# EAGLE schematic headstage-neuropix (EAGLE 8.3.2)
DESIGNER: JON NEWMAN; DESIGN_NAME: HEADSTAGE-NEUROPIX; LICENSE: CC BY-NC-SA 4.0; REVISION: 1.3
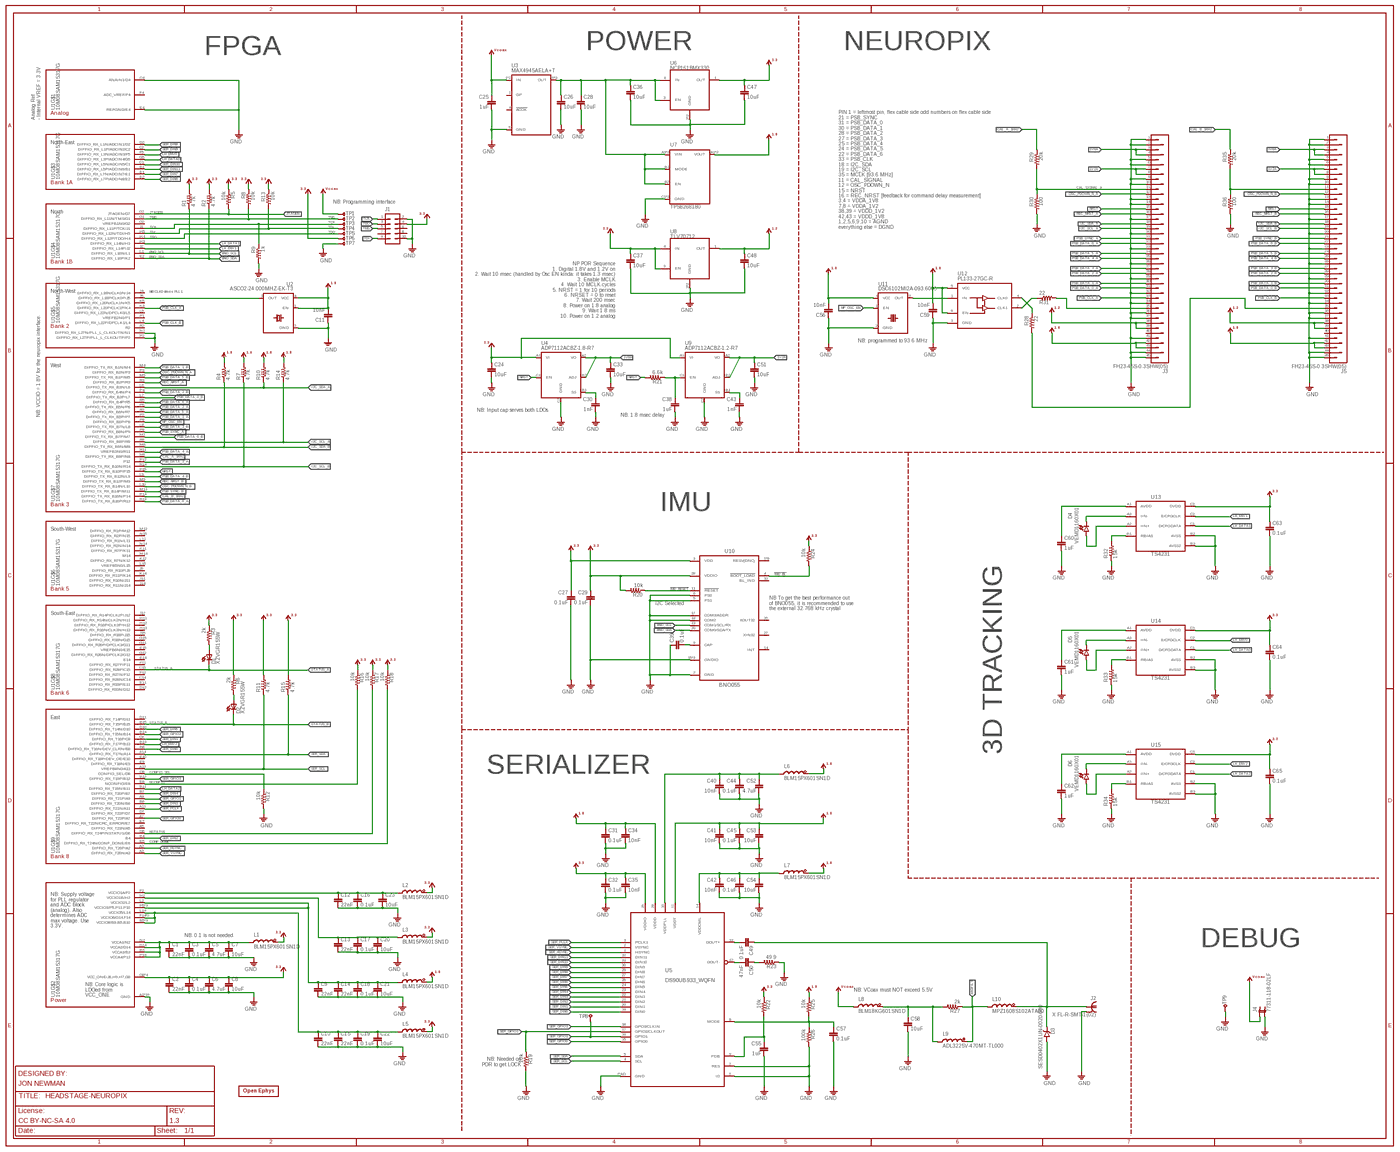
[diagram p0: schematic, sheet 1, overview]
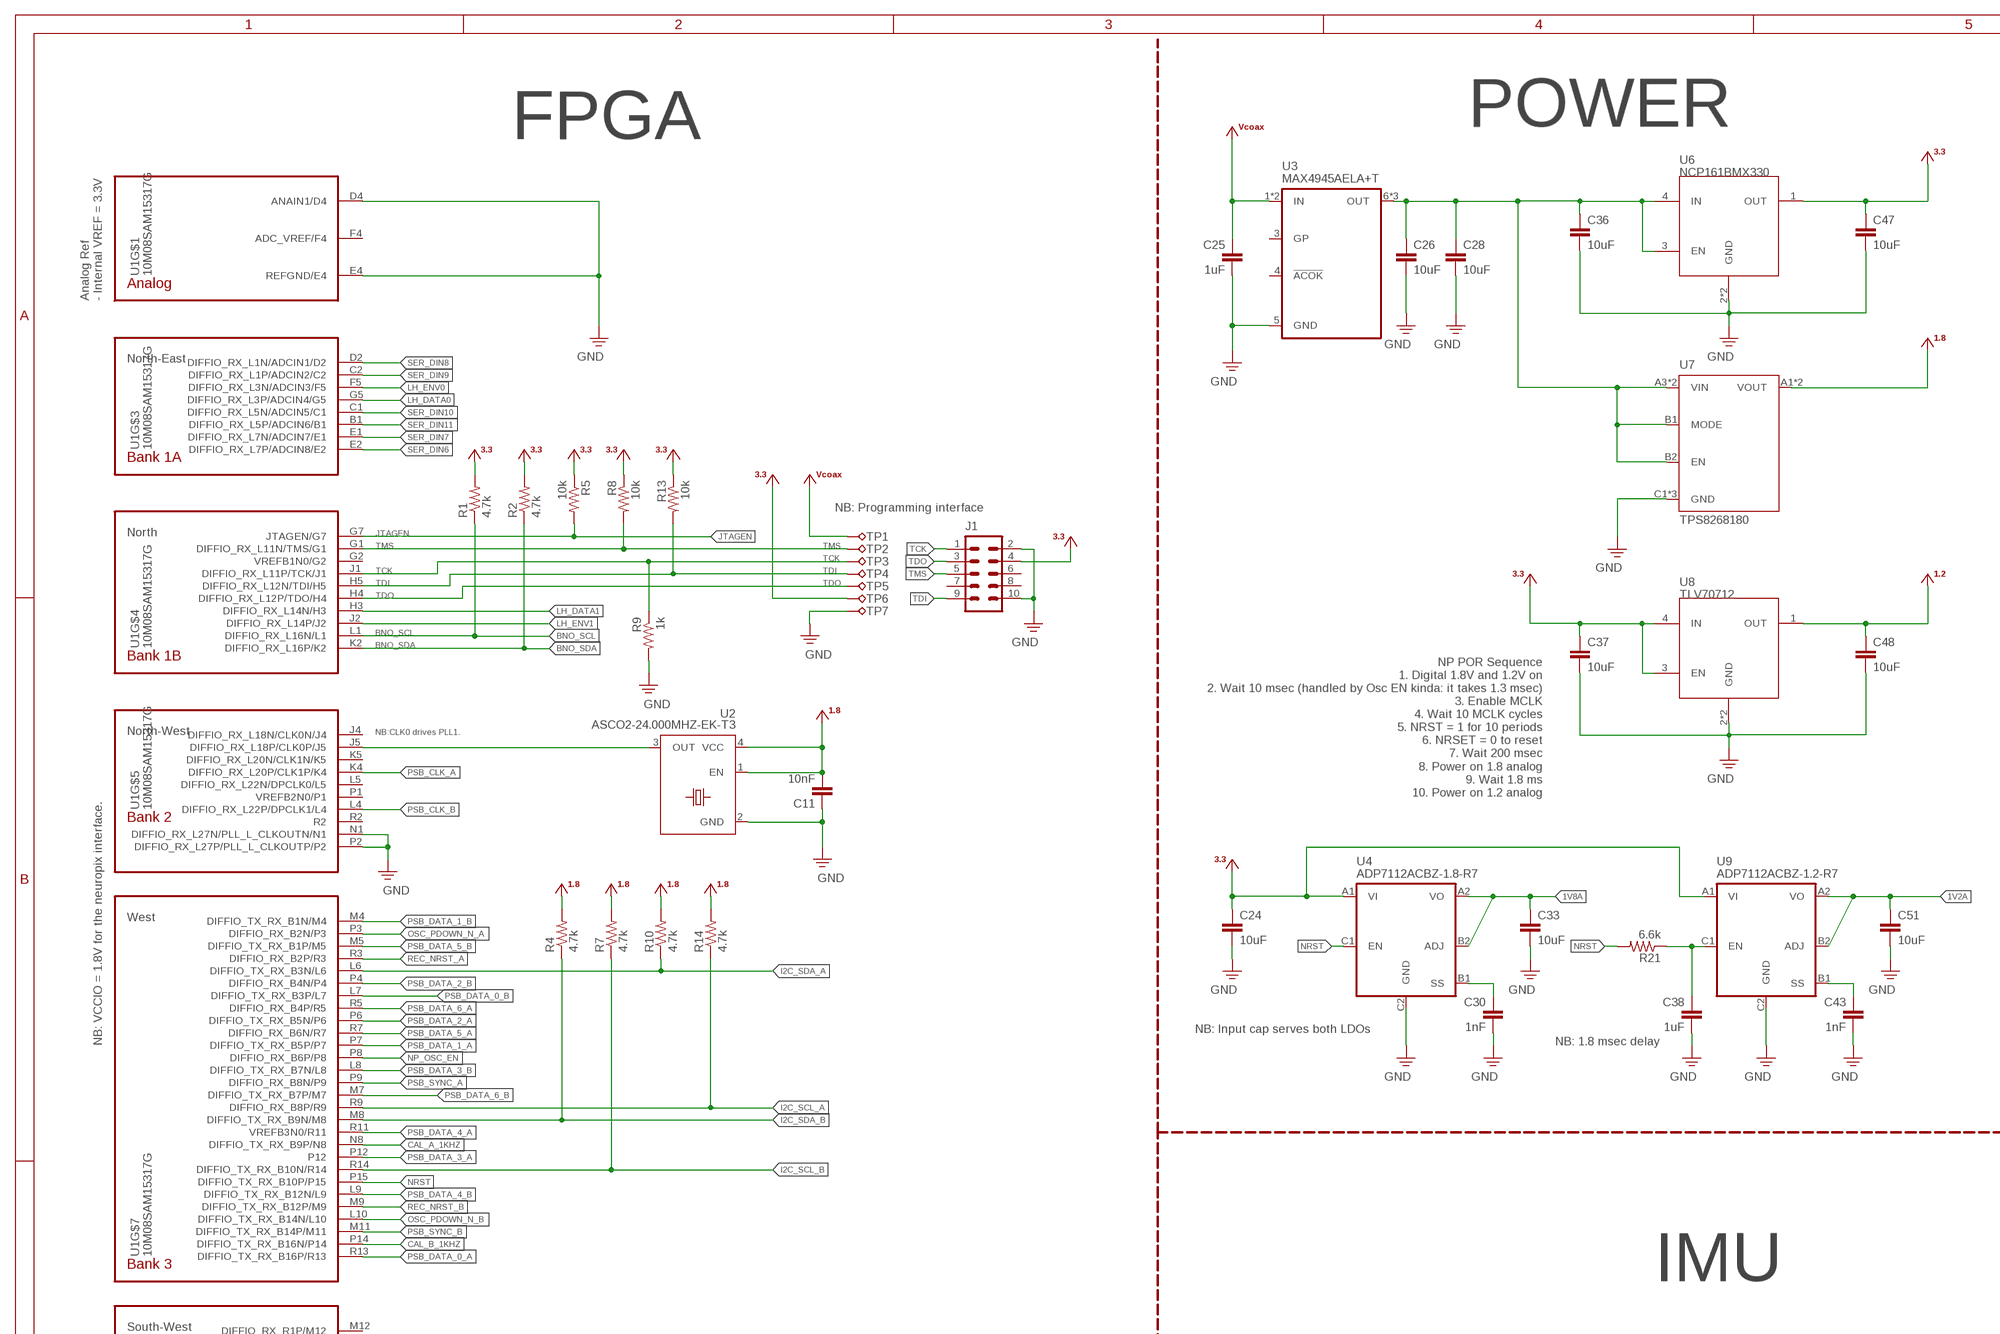
[diagram p1: schematic, sheet 1, part 1 of 4]
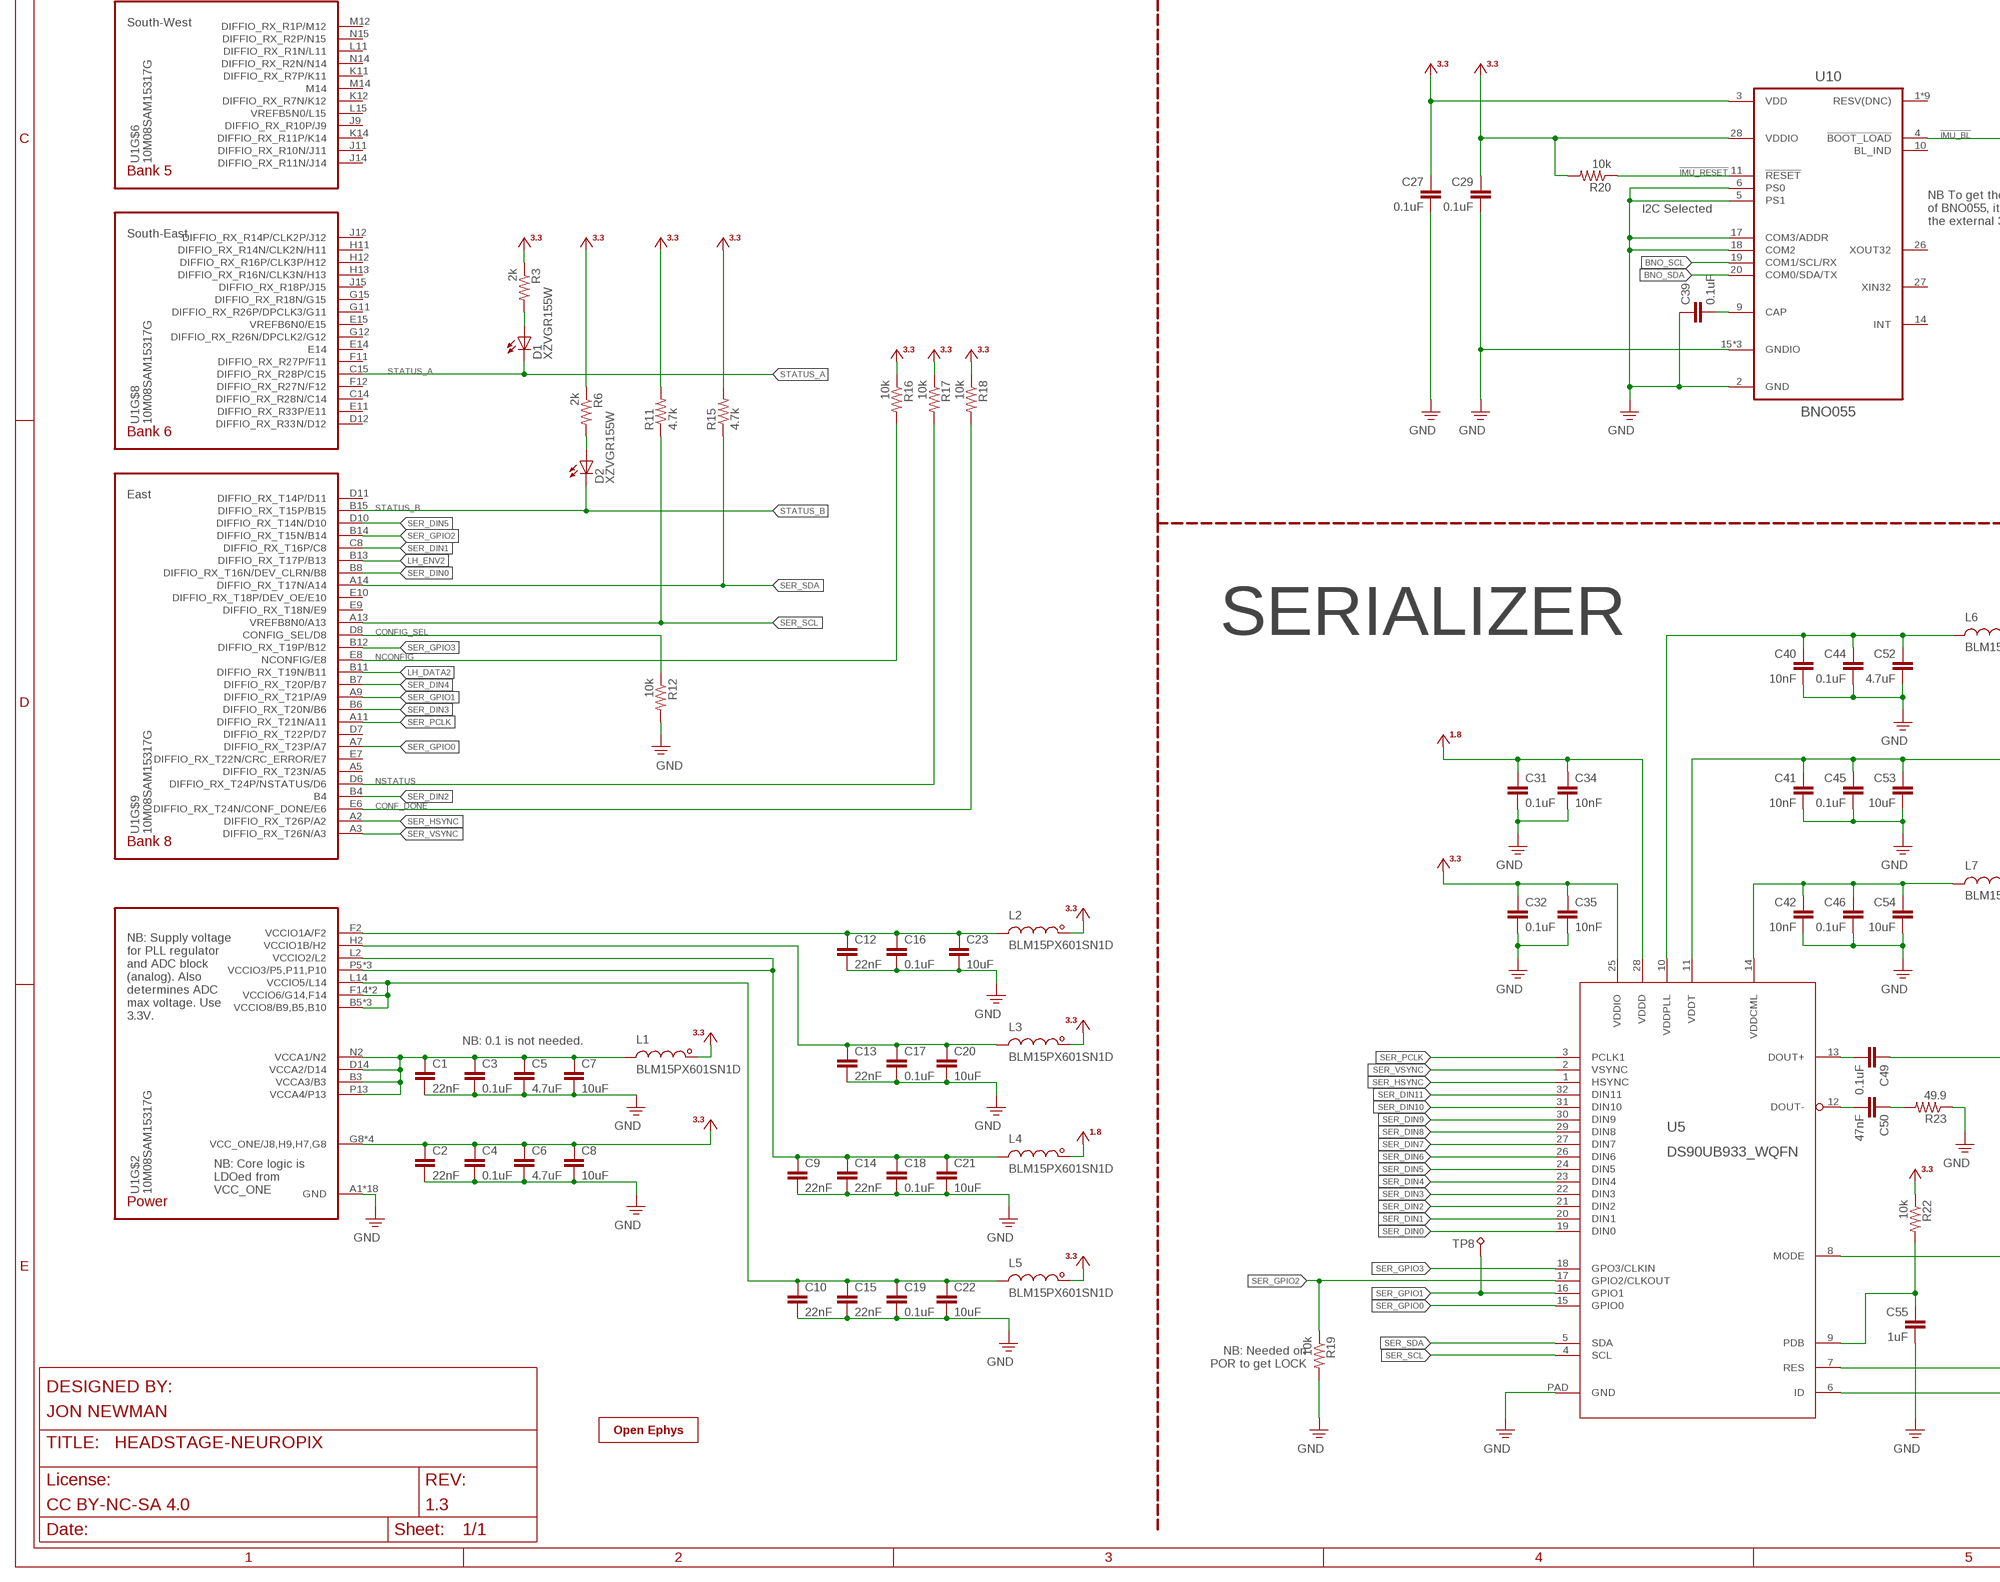
[diagram p2: schematic, sheet 1, part 2 of 4]
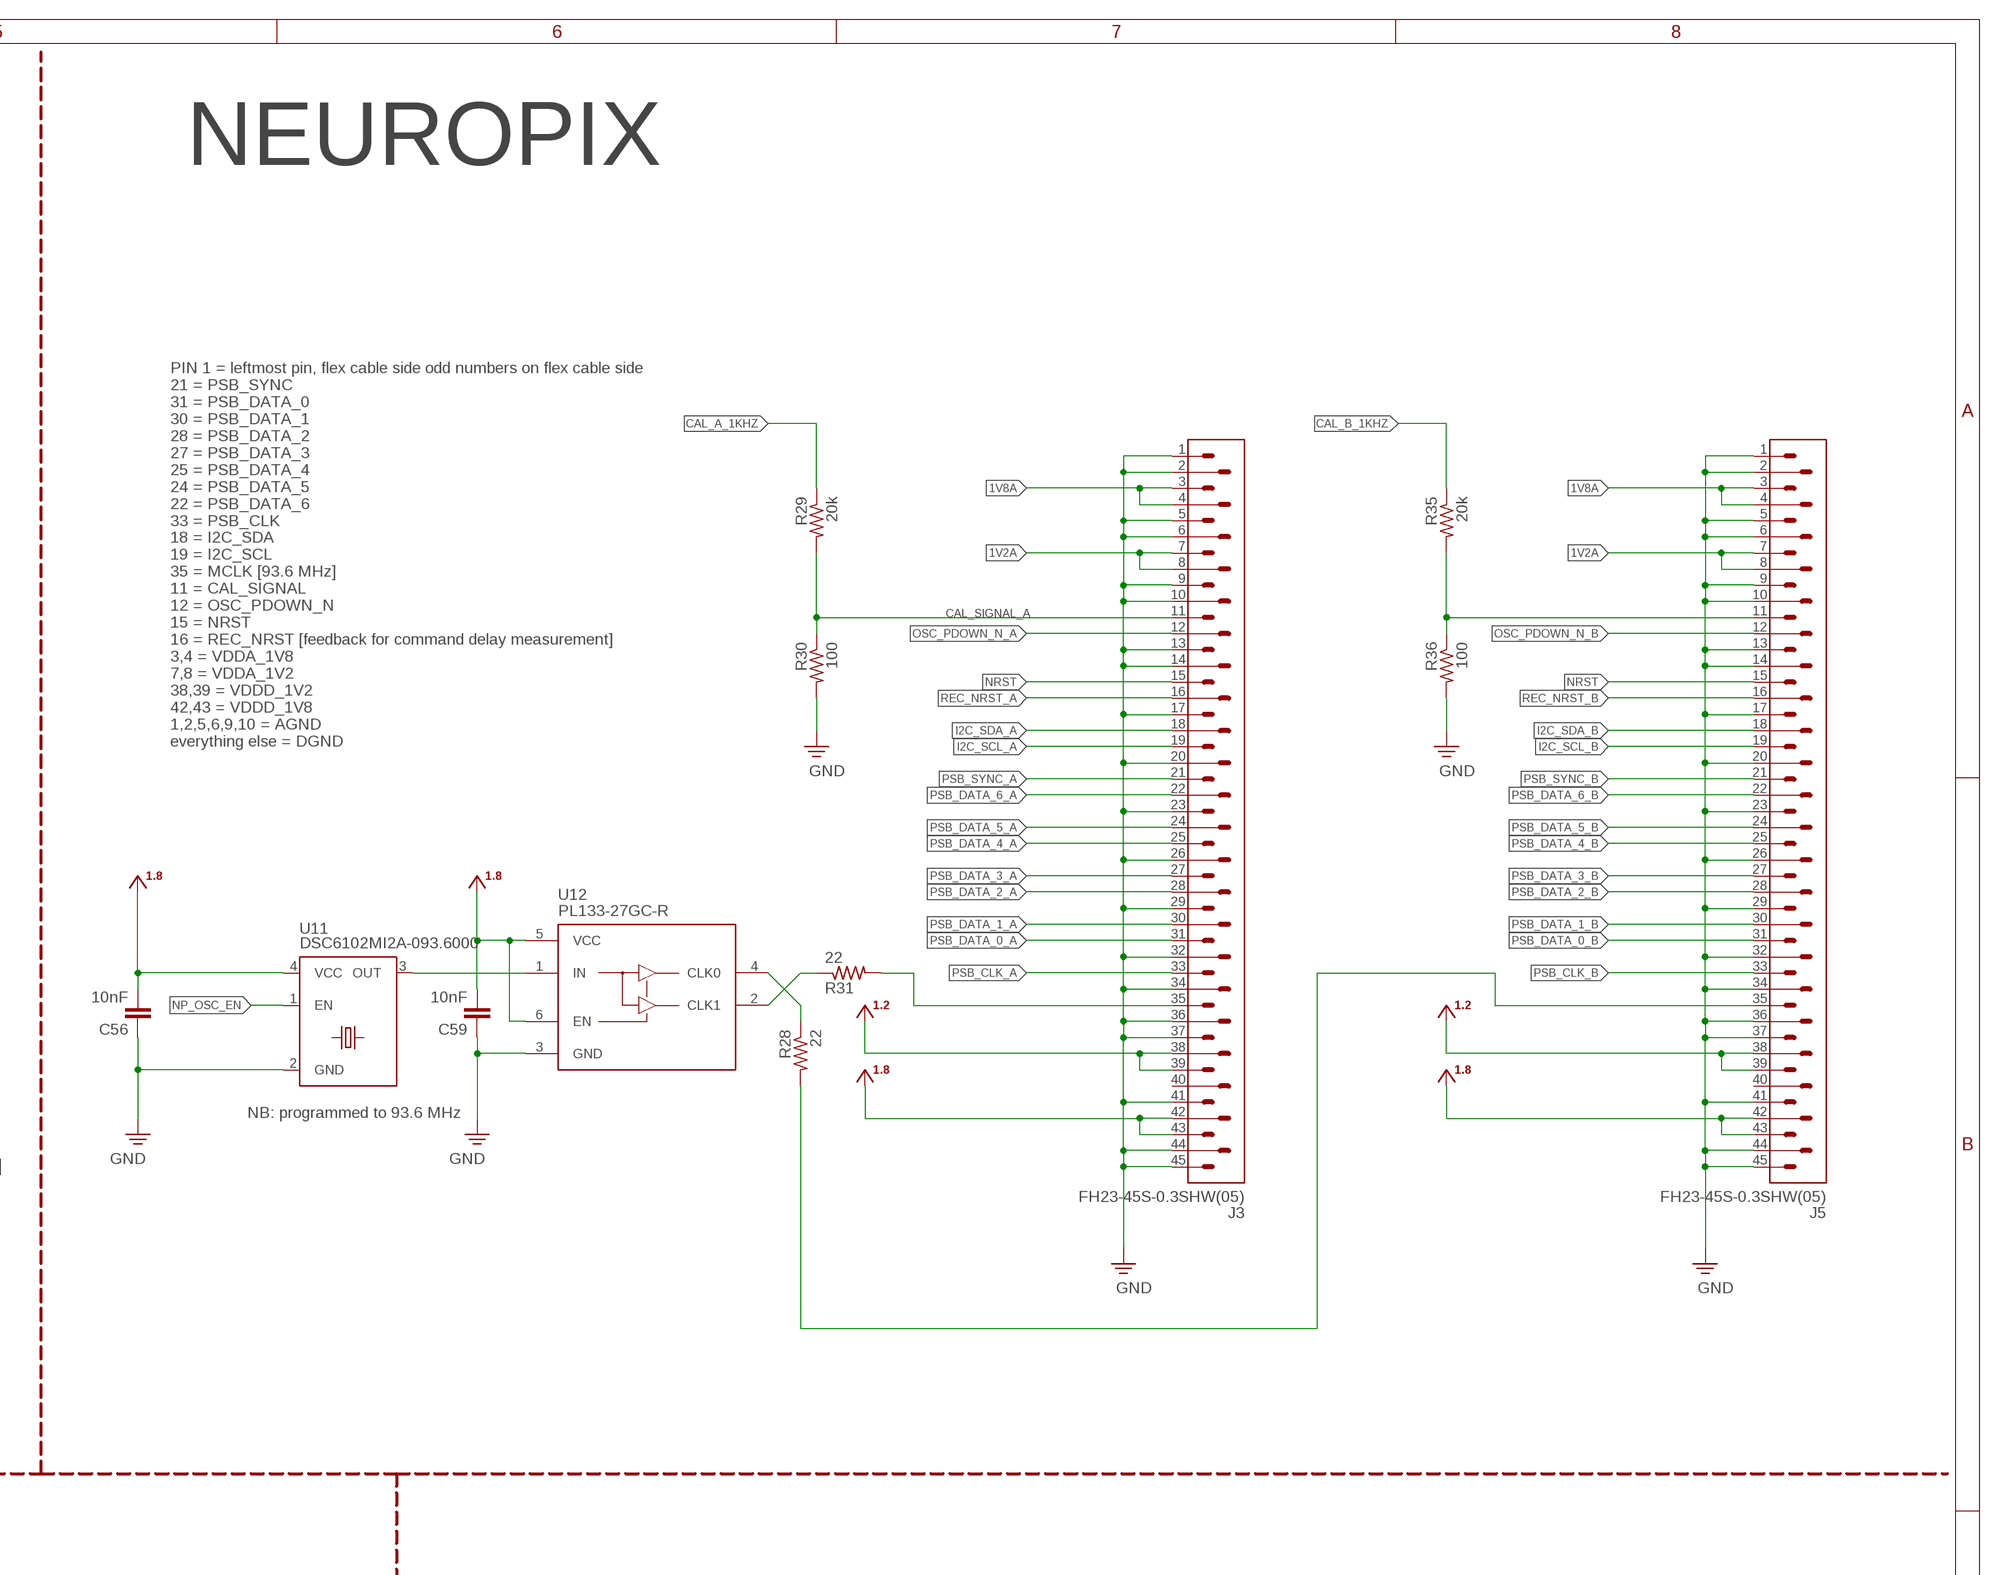
[diagram p3: schematic, sheet 1, part 3 of 4]
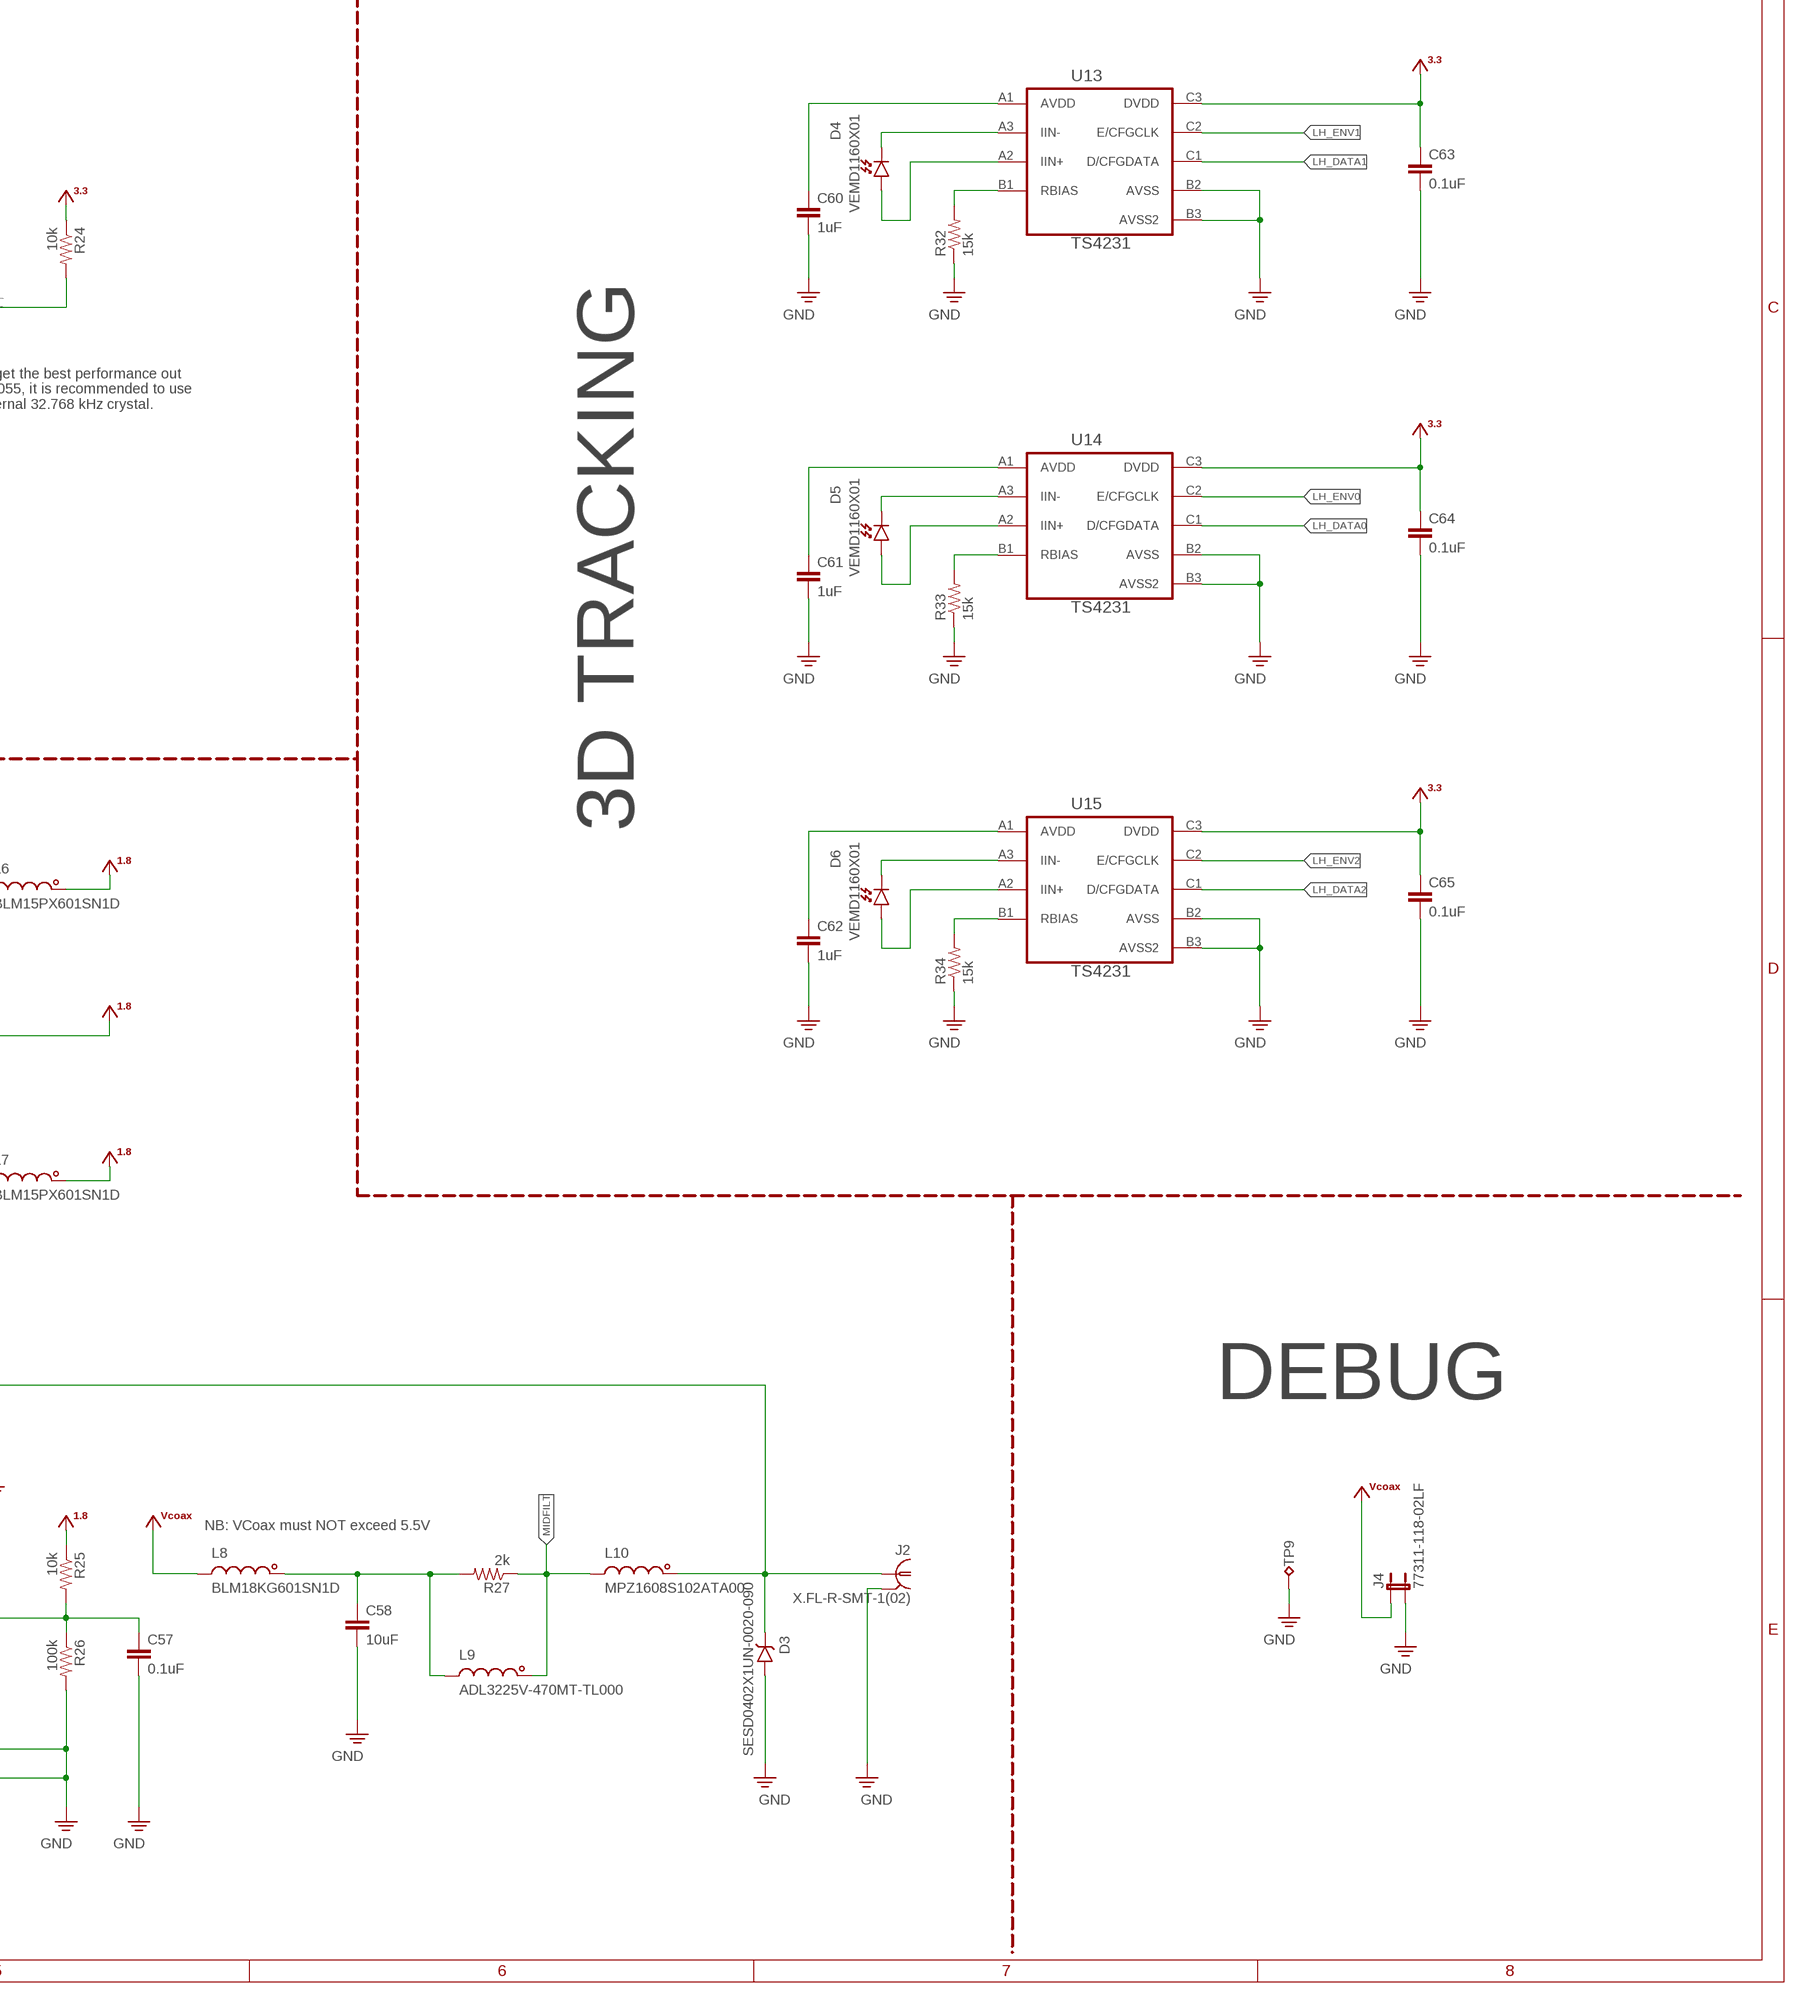
[diagram p4: schematic, sheet 1, part 4 of 4]

## Parts
C1  22nF  C_0201T  [0201T]
C2  22nF  C_0201T  [0201T]
C3  0.1uF  C_0201T  [0201T]
C4  0.1uF  C_0201T  [0201T]
C5  4.7uF  C_0402T  [0402T]
C6  4.7uF  C_0402T  [0402T]
C7  10uF  C_0402T  [0402T]
C8  10uF  C_0402T  [0402T]
C9  22nF  C_0201T  [0201T]
C10  22nF  C_0201T  [0201T]
C11  10nF  C_0201T  [0201T]
C12  22nF  C_0201T  [0201T]
C13  22nF  C_0201T  [0201T]
C14  22nF  C_0201T  [0201T]
C15  22nF  C_0201T  [0201T]
C16  0.1uF  C_0201T  [0201T]
C17  0.1uF  C_0201T  [0201T]
C18  0.1uF  C_0201T  [0201T]
C19  0.1uF  C_0201T  [0201T]
C20  10uF  C_0402T  [0402T]
C21  10uF  C_0402T  [0402T]
C22  10uF  C_0402T  [0402T]
C23  10uF  C_0402T  [0402T]
C24  10uF  C_0402TW  [0402TW]
C25  1uF  C_0201T  [0201T]
C26  10uF  C_0402TW  [0402TW]
C27  0.1uF  C_0201T  [0201T]
C28  10uF  C_0402TW  [0402TW]
C29  0.1uF  C_0201T  [0201T]
C30  1nF  C_0201T  [0201T]
C31  0.1uF  C_0201T  [0201T]
C32  0.1uF  C_0201T  [0201T]
C33  10uF  C_0402TW  [0402TW]
C34  10nF  C_0201T  [0201T]
C35  10nF  C_0201T  [0201T]
C36  10uF  C_0402TW  [0402TW]
C37  10uF  C_0402TW  [0402TW]
C38  1uF  C_0201T  [0201T]
C39  0.1uF  C_0201T  [0201T]
C40  10nF  C_0201T  [0201T]
C41  10nF  C_0201T  [0201T]
C42  10nF  C_0201T  [0201T]
C43  1nF  C_0201T  [0201T]
C44  0.1uF  C_0201T  [0201T]
C45  0.1uF  C_0201T  [0201T]
C46  0.1uF  C_0201T  [0201T]
C47  10uF  C_0402TW  [0402TW]
C48  10uF  C_0402TW  [0402TW]
C49  0.1uF  C_0201T  [0201T]
C50  47nF  C_0201T  [0201T]
C51  10uF  C_0402TW  [0402TW]
C52  4.7uF  C_0402T  [0402T]
C53  10uF  C_0402T  [0402T]
C54  10uF  C_0402TW  [0402TW]
C55  1uF  C_0201T  [0201T]
C56  10nF  C_0201T  [0201T]
C57  0.1uF  C_0201T  [0201T]
C58  10uF  C_0402T  [0402T]
C59  10nF  C_0201T  [0201T]
C60  1uF  C_0201T  [0201T]
C61  1uF  C_0201T  [0201T]
C62  1uF  C_0201T  [0201T]
C63  0.1uF  C_0201T  [0201T]
C64  0.1uF  C_0201T  [0201T]
C65  0.1uF  C_0201T  [0201T]
D1  XZVGR155W  LED_0201T  [LED-0201T]
D2  XZVGR155W  LED_0201T  [LED-0201T]
D3  SESD0402X1UN-0020-090  Z-DIODE_0402T-DFN  [0402T-DFN]
D4  VEMD1160X01  PHOTODIODE0805PT-NOSILK  [0805PT-NOSILK]
D5  VEMD1160X01  PHOTODIODE0805PT-NOSILK  [0805PT-NOSILK]
D6  VEMD1160X01  PHOTODIODE0805PT-NOSILK  [0805PT-NOSILK]
J1  302-S101  PINHD-2X5_IDC  [2X05_IDC]
J2  X.FL-R-SMT-1(02)  COAX_XFL  [X_FL_R_SMT_1(02)]
J3  FH23-45S-0.3SHW(05)  PINHD-1X45_FH23  [FH23-45S-0.3SHW(05)]
J4  77311-118-02LF  JP2E_THRU-HOLE  [JP2]
J5  FH23-45S-0.3SHW(05)  PINHD-1X45_FH23  [FH23-45S-0.3SHW(05)]
L1  BLM15PX601SN1D  L_0402T  [0402T]
L2  BLM15PX601SN1D  L_0402T  [0402T]
L3  BLM15PX601SN1D  L_0402T  [0402T]
L4  BLM15PX601SN1D  L_0402T  [0402T]
L5  BLM15PX601SN1D  L_0402T  [0402T]
L6  BLM15PX601SN1D  L_0402T  [0402T]
L7  BLM15PX601SN1D  L_0402T  [0402T]
L8  BLM18KG601SN1D  L_0603T  [0603T]
L9  ADL3225V-470MT-TL000  L_1210T  [1210T]
L10  MPZ1608S102ATA00  L_0603T  [0603T]
R1  4.7k  R_0201T  [0201T]
R2  4.7k  R_0201T  [0201T]
R3  2k  R_0201T  [0201T]
R4  4.7k  R_0201T  [0201T]
R5  10k  R_0201T  [0201T]
R6  2k  R_0201T  [0201T]
R7  4.7k  R_0201T  [0201T]
R8  10k  R_0201T  [0201T]
R9  1k  R_0201T  [0201T]
R10  4.7k  R_0201T  [0201T]
R11  4.7k  R_0201T  [0201T]
R12  10k  R_0201T  [0201T]
R13  10k  R_0201T  [0201T]
R14  4.7k  R_0201T  [0201T]
R15  4.7k  R_0201T  [0201T]
R16  10k  R_0201T  [0201T]
R17  10k  R_0201T  [0201T]
R18  10k  R_0201T  [0201T]
R19  10k  R_0201T  [0201T]
R20  10k  R_0201T  [0201T]
R21  6.6k  R_0201T  [0201T]
R22  10k  R_0201T  [0201T]
R23  49.9  R_0201T  [0201T]
R24  10k  R_0201T  [0201T]
R25  10k  R_0201T  [0201T]
R26  100k  R_0201T  [0201T]
R27  2k  R_0201T  [0201T]
R28  22  R_0201T  [0201T]
R29  20k  R_0201T  [0201T]
R30  100  R_0201T  [0201T]
R31  22  R_0201T  [0201T]
R32  15k  R_0201T  [0201T]
R33  15k  R_0201T  [0201T]
R34  15k  R_0201T  [0201T]
R35  20k  R_0201T  [0201T]
R36  100  R_0201T  [0201T]
TP1  TPTP10R  [TP10R]
TP2  TPTP10R  [TP10R]
TP3  TPTP10R  [TP10R]
TP4  TPTP10R  [TP10R]
TP5  TPTP10R  [TP10R]
TP6  TPTP10R  [TP10R]
TP7  TPTP10R  [TP10R]
TP8  TPTP09R  [TP09R]
TP9  TPTP20R  [TP20R]
U1  10M08SAM15317G  10M08SAM153_MBGA  [MBGA153-8X8]
U2  ASCO2-24.000MHZ-EK-T3  CRYSTAL-OSC_ASCO  [ASCO]
U3  MAX4945AELA+T  MAX494X  [UDFN8-2X2]
U4  ADP7112ACBZ-1.8-R7  LDO_ADJUST-EN-SS_WLCSP-ADP7112  [WLCSP6-1X1.2]
U5  DS90UB933_WQFN  DS90UB913A_WQFN  [WQFN32-5X5]
U6  NCP161BMX330  TLV707  [X2SON]
U7  TPS8268180  TPS8268X  [MICROSIP9-3X2.3]
U8  TLV70712  TLV707  [X2SON]
U9  ADP7112ACBZ-1.2-R7  LDO_ADJUST-EN-SS_WLCSP-ADP7112  [WLCSP6-1X1.2]
U10  BNO055  [LGA-28-3.8X5.2]
U11  DSC6102MI2A-093.6000  CRYSTAL-OSC_VFLGA4-2X1.6  [VFLGA4-2.0X1.6]
U12  PL133-27GC-R  CLKBUF2_DFN_2X1.3_PAD  [DFN6_2X1.3_PAD]
U13  TS4231  [WLCSP3X3]
U14  TS4231  [WLCSP3X3]
U15  TS4231  [WLCSP3X3]
X2  OE-LOGO_14X10  [OE-LOGO-14X10]

## Nets
1V2A: C51.1 J3.7 J3.8 J5.7 J5.8 U9.A2(VO) U9.B2(ADJ)
1V8A: C33.1 J3.3 J3.4 J5.3 J5.4 U4.A2(VO) U4.B2(ADJ)
24MHZ_P: U1.J5(DIFFIO_RX_L18P/CLK0P/J5) U2.3(OUT)
!IMU_BL: R24.2 U10.4(!BOOT_LOAD)
!IMU_RESET: R20.1 U10.11(!RESET)
+1V2: C48.1 J3.38 J3.39 J5.38 J5.39 U8.1(OUT)
+1V8: C11.2 C31.1 C34.1 C41.1 C45.1 C53.1 C56.2 C59.2 J3.42 J3.43 J5.42 J5.43 L4.1 L6.1 L7.1 R4.2 R7.2 R10.2 R14.2 R25.1 U2.1(EN) U2.4(VCC) U5.11(VDDT) U5.28(VDDD) U7.A1(VOUT) U7.A2(VOUT) U11.4(VCC) U12.5(VCC) U12.6(EN)
+3V3: C2.1 C4.1 C6.1 C8.1 C24.1 C27.1 C29.1 C32.1 C35.1 C37.1 C47.1 C63.1 C64.1 C65.1 J1.4 L1.1 L2.1 L3.1 L5.1 R1.2 R2.2 R3.1 R5.1 R6.1 R8.1 R11.2 R13.1 R15.2 R16.1 R17.1 R18.1 R20.2 R22.1 R24.1 TP6.TP U1.G8(VCC_ONE/J8,H9,H7,G8) U1.H7(VCC_ONE/J8,H9,H7,G8) U1.H9(VCC_ONE/J8,H9,H7,G8) U1.J8(VCC_ONE/J8,H9,H7,G8) U4.A1(VI) U5.25(VDDIO) U6.1(OUT) U8.3(EN) U8.4(IN) U9.A1(VI) U10.3(VDD) U10.28(VDDIO) U13.C3(DVDD) U14.C3(DVDD) U15.C3(DVDD)
BNO_SCL: R1.1 U1.L1(DIFFIO_RX_L16N/L1) U10.19(COM1/SCL/RX)
BNO_SDA: R2.1 U1.K2(DIFFIO_RX_L16P/K2) U10.20(COM0/SDA/TX)
CAL_A_1KHZ: R29.1 U1.N8(DIFFIO_TX_RX_B9P/N8)
CAL_B_1KHZ: R35.1 U1.P14(DIFFIO_TX_RX_B16N/P14)
CAL_SIGNAL_A: J3.11 R29.2 R30.1
CAL_SIGNAL_A1: J5.11 R35.2 R36.1
CONF_DONE: R18.2 U1.E6(DIFFIO_RX_T24N/CONF_DONE/E6)
CONFIG_SEL: R12.1 U1.D8(CONFIG_SEL/D8)
GND: C1.2 C2.2 C3.2 C4.2 C5.2 C6.2 C7.2 C8.2 C9.2 C10.2 C11.1 C12.2 C13.2 C14.2 C15.2 C16.2 C17.2 C18.2 C19.2 C20.2 C21.2 C22.2 C23.2 C24.2 C25.2 C26.2 C27.2 C28.2 C29.2 C30.2 C31.2 C32.2 C33.2 C34.2 C35.2 C36.2 C37.2 C38.2 C39.1 C40.2 C41.2 C42.2 C43.2 C44.2 C45.2 C46.2 C47.2 C48.2 C51.2 C52.2 C53.2 C54.2 C55.2 C56.1 C57.2 C58.2 C59.1 C60.2 C61.2 C62.2 C63.2 C64.2 C65.2 D3.A J1.2 J1.10 J2.P$2 J2.P$3 J2.P$4 J3.1 J3.2 J3.5 J3.6 J3.9 J3.10 J3.13 J3.14 J3.17 J3.20 J3.23 J3.26 J3.29 J3.32 J3.34 J3.36 J3.37 J3.41 J3.44 J3.45 J4.2 J5.1 J5.2 J5.5 J5.6 J5.9 J5.10 J5.13 J5.14 J5.17 J5.20 J5.23 J5.26 J5.29 J5.32 J5.34 J5.36 J5.37 J5.41 J5.44 J5.45 R9.2 R12.2 R19.2 R23.1 R26.2 R30.2 R32.1 R33.1 R34.1 R36.2 TP7.TP TP9.TP U1.A1(GND) U1.A15(GND) U1.B2(GND) U1.D4(ANAIN1/D4) U1.D5(GND) U1.D9(GND) U1.E4(REFGND/E4) U1.E5(GND) U1.E12(GND) U1.G4(GND) U1.G9(GND) U1.H8(GND) U1.H14(GND) U1.J7(GND) U1.L12(GND) U1.M2(GND) U1.M6(GND) U1.M10(GND) U1.N1(DIFFIO_RX_L27N/PLL_L_CLKOUTN/N1) U1.P2(DIFFIO_RX_L27P/PLL_L_CLKOUTP/P2) U1.R1(GND) U1.R15(GND) U2.2(GND) U3.5(GND) U4.C2(GND) U5.6(ID) U5.7(RES) U5.PAD(GND) U6.2(GND) U6.PAD(GND) U7.C1(GND) U7.C2(GND) U7.C3(GND) U8.2(GND) U8.PAD(GND) U9.C2(GND) U10.2(GND) U10.5(PS1) U10.6(PS0) U10.15(GNDIO) U10.16(GNDIO) U10.17(COM3/ADDR) U10.18(COM2) U10.25(GNDIO) U11.2(GND) U12.3(GND) U13.B2(AVSS) U13.B3(AVSS2) U14.B2(AVSS) U14.B3(AVSS2) U15.B2(AVSS) U15.B3(AVSS2)
I2C_SCL_A: J3.19 R14.1 U1.R9(DIFFIO_RX_B8P/R9)
I2C_SCL_B: J5.19 R7.1 U1.R14(DIFFIO_TX_RX_B10N/R14)
I2C_SDA_A: J3.18 R10.1 U1.L6(DIFFIO_TX_RX_B3N/L6)
I2C_SDA_B: J5.18 R4.1 U1.M8(DIFFIO_TX_RX_B9N/M8)
JTAGEN: R5.2 U1.G7(JTAGEN/G7)
LH_DATA0: U1.G5(DIFFIO_RX_L3P/ADCIN4/G5) U14.C1(D/CFGDATA)
LH_DATA1: U1.H3(DIFFIO_RX_L14N/H3) U13.C1(D/CFGDATA)
LH_DATA2: U1.B11(DIFFIO_RX_T19N/B11) U15.C1(D/CFGDATA)
LH_ENV0: U1.F5(DIFFIO_RX_L3N/ADCIN3/F5) U14.C2(E/CFGCLK)
LH_ENV1: U1.J2(DIFFIO_RX_L14P/J2) U13.C2(E/CFGCLK)
LH_ENV2: U1.B13(DIFFIO_RX_T17P/B13) U15.C2(E/CFGCLK)
MIDFILT: L9.1 L10.2 R27.1
N$1: U11.3(OUT) U12.1(IN)
N$2: R28.1 U12.4(CLK0)
N$3: J3.35 R31.2
N$4: C13.1 C17.1 C20.1 L3.2 U1.H2(VCCIO1B/H2)
N$5: J5.35 R28.2
N$6: R31.1 U12.2(CLK1)
N$7: D4.C U13.A3(IIN-)
N$8: D4.A U13.A2(IIN+)
N$9: R32.2 U13.B1(RBIAS)
N$12: C60.1 U13.A1(AVDD)
N$13: C58.1 L8.1 L9.2 R27.2
N$14: D5.C U14.A3(IIN-)
N$15: D5.A U14.A2(IIN+)
N$16: R33.2 U14.B1(RBIAS)
N$26: D6.C U15.A3(IIN-)
N$27: D6.A U15.A2(IIN+)
N$28: C49.2 U5.13(DOUT+)
N$29: R34.2 U15.B1(RBIAS)
N$30: C55.1 R22.2 U5.9(PDB)
N$31: C50.2 U5.12(DOUT-)
N$32: C50.1 R23.2
N$33: C57.1 R25.2 R26.1 U5.8(MODE)
N$34: C40.1 C44.1 C52.1 L6.2 U5.10(VDDPLL)
N$35: C42.1 C46.1 C54.1 L7.2 U5.14(VDDCML)
N$36: C61.1 U14.A1(AVDD)
N$37: C62.1 U15.A1(AVDD)
N$38: C26.1 C28.1 C36.1 U3.6(OUT) U3.7(OUT) U3.8(OUT) U6.3(EN) U6.4(IN) U7.A3(VIN) U7.B1(MODE) U7.B2(EN) U7.B3(VIN)
N$39: C30.1 U4.B1(SS)
N$40: C43.1 U9.B1(SS)
N$41: C38.1 R21.1 U9.C1(EN)
N$67: C39.2 U10.9(CAP)
N$92: D2.2(A) R6.2
N$93: D1.2(A) R3.2
NCONFIG: R16.2 U1.E8(NCONFIG/E8)
NP_OSC_EN: U1.P8(DIFFIO_RX_B6P/P8) U11.1(EN)
NRST: J3.15 J5.15 R21.2 U1.P15(DIFFIO_TX_RX_B10P/P15) U4.C1(EN)
NSTATUS: R17.2 U1.D6(DIFFIO_RX_T24P/NSTATUS/D6)
OSC_PDOWN_N_A: J3.12 U1.P3(DIFFIO_RX_B2N/P3)
OSC_PDOWN_N_B: J5.12 U1.L10(DIFFIO_TX_RX_B14N/L10)
PSB_CLK_A: J3.33 U1.K4(DIFFIO_RX_L20P/CLK1P/K4)
PSB_CLK_B: J5.33 U1.L4(DIFFIO_RX_L22P/DPCLK1/L4)
PSB_DATA_0_A: J3.31 U1.R13(DIFFIO_TX_RX_B16P/R13)
PSB_DATA_0_B: J5.31 U1.L7(DIFFIO_TX_RX_B3P/L7)
PSB_DATA_1_A: J3.30 U1.P7(DIFFIO_TX_RX_B5P/P7)
PSB_DATA_1_B: J5.30 U1.M4(DIFFIO_TX_RX_B1N/M4)
PSB_DATA_2_A: J3.28 U1.P6(DIFFIO_TX_RX_B5N/P6)
PSB_DATA_2_B: J5.28 U1.P4(DIFFIO_RX_B4N/P4)
PSB_DATA_3_A: J3.27 U1.P12
PSB_DATA_3_B: J5.27 U1.L8(DIFFIO_TX_RX_B7N/L8)
PSB_DATA_4_A: J3.25 U1.R11(VREFB3N0/R11)
PSB_DATA_4_B: J5.25 U1.L9(DIFFIO_TX_RX_B12N/L9)
PSB_DATA_5_A: J3.24 U1.R7(DIFFIO_RX_B6N/R7)
PSB_DATA_5_B: J5.24 U1.M5(DIFFIO_TX_RX_B1P/M5)
PSB_DATA_6_A: J3.22 U1.R5(DIFFIO_RX_B4P/R5)
PSB_DATA_6_B: J5.22 U1.M7(DIFFIO_TX_RX_B7P/M7)
PSB_SYNC_A: J3.21 U1.P9(DIFFIO_RX_B8N/P9)
PSB_SYNC_B: J5.21 U1.M11(DIFFIO_TX_RX_B14P/M11)
REC_NRST_A: J3.16 U1.R3(DIFFIO_RX_B2P/R3)
REC_NRST_B: J5.16 U1.M9(DIFFIO_TX_RX_B12P/M9)
SER_DIN0: U1.B8(DIFFIO_RX_T16N/DEV_CLRN/B8) U5.19(DIN0)
SER_DIN1: U1.C8(DIFFIO_RX_T16P/C8) U5.20(DIN1)
SER_DIN2: U1.B4 U5.21(DIN2)
SER_DIN3: U1.B6(DIFFIO_RX_T20N/B6) U5.22(DIN3)
SER_DIN4: U1.B7(DIFFIO_RX_T20P/B7) U5.23(DIN4)
SER_DIN5: U1.D10(DIFFIO_RX_T14N/D10) U5.24(DIN5)
SER_DIN6: U1.E2(DIFFIO_RX_L7P/ADCIN8/E2) U5.26(DIN6)
SER_DIN7: U1.E1(DIFFIO_RX_L7N/ADCIN7/E1) U5.27(DIN7)
SER_DIN8: U1.D2(DIFFIO_RX_L1N/ADCIN1/D2) U5.29(DIN8)
SER_DIN9: U1.C2(DIFFIO_RX_L1P/ADCIN2/C2) U5.30(DIN9)
SER_DIN10: U1.C1(DIFFIO_RX_L5N/ADCIN5/C1) U5.31(DIN10)
SER_DIN11: U1.B1(DIFFIO_RX_L5P/ADCIN6/B1) U5.32(DIN11)
SER_GPIO0: U1.A7(DIFFIO_RX_T23P/A7) U5.15(GPIO0)
SER_GPIO1: TP8.TP U1.A9(DIFFIO_RX_T21P/A9) U5.16(GPIO1)
SER_GPIO2: R19.1 U1.B14(DIFFIO_RX_T15N/B14) U5.17(GPIO2/CLKOUT)
SER_GPIO3: U1.B12(DIFFIO_RX_T19P/B12) U5.18(GPO3/CLKIN)
SER_HSYNC: U1.A2(DIFFIO_RX_T26P/A2) U5.1(HSYNC)
SER_PCLK: U1.A11(DIFFIO_RX_T21N/A11) U5.3(PCLK1)
SER_SCL: R11.1 U1.A13(VREFB8N0/A13) U5.4(SCL)
SER_SDA: R15.1 U1.A14(DIFFIO_RX_T17N/A14) U5.5(SDA)
SER_VSYNC: U1.A3(DIFFIO_RX_T26N/A3) U5.2(VSYNC)
SIGOUT: C49.1 D3.C J2.P$1 L10.1
STATUS_A: D1.1(C) U1.C15(DIFFIO_RX_R28P/C15)
STATUS_B: D2.1(C) U1.B15(DIFFIO_RX_T15P/B15)
TCK: J1.1 R9.1 TP3.TP U1.J1(DIFFIO_RX_L11P/TCK/J1)
TDI: J1.9 R13.2 TP4.TP U1.H5(DIFFIO_RX_L12N/TDI/H5)
TDO: J1.3 TP5.TP U1.H4(DIFFIO_RX_L12P/TDO/H4)
TMS: J1.5 R8.2 TP2.TP U1.G1(DIFFIO_RX_L11N/TMS/G1)
VCCA: C1.1 C3.1 C5.1 C7.1 L1.2 U1.B3(VCCA3/B3) U1.D14(VCCA2/D14) U1.N2(VCCA1/N2) U1.P13(VCCA4/P13)
VCCIO: C10.1 C15.1 C19.1 C22.1 L5.2 U1.B5(VCCIO8/B9,B5,B10) U1.B9(VCCIO8/B9,B5,B10) U1.B10(VCCIO8/B9,B5,B10) U1.F14(VCCIO6/G14,F14) U1.G14(VCCIO6/G14,F14) U1.L14(VCCIO5/L14)
VCCIO2: C9.1 C14.1 C18.1 C21.1 L4.2 U1.L2(VCCIO2/L2) U1.P5(VCCIO3/P5,P11,P10) U1.P10(VCCIO3/P5,P11,P10) U1.P11(VCCIO3/P5,P11,P10)
VCCIOA: C12.1 C16.1 C23.1 L2.2 U1.F2(VCCIO1A/F2)
VCOAX: C25.1 J4.1 L8.2 TP1.TP U3.1(IN) U3.2(IN) ; supply symbol labelled +VCOAX
Unconnected: J1.6 J1.7 J1.8 J3.40 J5.40 U1.A5(DIFFIO_RX_T23N/A5) U1.C14(DIFFIO_RX_R28N/C14) U1.D7(DIFFIO_RX_T22P/D7) U1.D11(DIFFIO_RX_T14P/D11) U1.D12(DIFFIO_RX_R33N/D12) U1.E7(DIFFIO_RX_T22N/CRC_ERROR/E7) U1.E9(DIFFIO_RX_T18N/E9) U1.E10(DIFFIO_RX_T18P/DEV_OE/E10) U1.E11(DIFFIO_RX_R33P/E11) U1.E14 U1.E15(VREFB6N0/E15) U1.F4(ADC_VREF/F4) U1.F11(DIFFIO_RX_R27P/F11) U1.F12(DIFFIO_RX_R27N/F12) U1.G2(VREFB1N0/G2) U1.G11(DIFFIO_RX_R26P/DPCLK3/G11) U1.G12(DIFFIO_RX_R26N/DPCLK2/G12) U1.G15(DIFFIO_RX_R18N/G15) U1.H11(DIFFIO_RX_R14N/CLK2N/H11) U1.H12(DIFFIO_RX_R16P/CLK3P/H12) U1.H13(DIFFIO_RX_R16N/CLK3N/H13) U1.J4(DIFFIO_RX_L18N/CLK0N/J4) U1.J9(DIFFIO_RX_R10P/J9) U1.J11(DIFFIO_RX_R10N/J11) U1.J12(DIFFIO_RX_R14P/CLK2P/J12) U1.J14(DIFFIO_RX_R11N/J14) U1.J15(DIFFIO_RX_R18P/J15) U1.K5(DIFFIO_RX_L20N/CLK1N/K5) U1.K11(DIFFIO_RX_R7P/K11) U1.K12(DIFFIO_RX_R7N/K12) U1.K14(DIFFIO_RX_R11P/K14) U1.L5(DIFFIO_RX_L22N/DPCLK0/L5) U1.L11(DIFFIO_RX_R1N/L11) U1.L15(VREFB5N0/L15) U1.M12(DIFFIO_RX_R1P/M12) U1.M14 U1.N14(DIFFIO_RX_R2N/N14) U1.N15(DIFFIO_RX_R2P/N15) U1.P1(VREFB2N0/P1) U1.R2 U3.3(GP) U3.4(!ACOK) U10.1(RESV(DNC)) U10.7(RESV(DNC)) U10.8(RESV(DNC)) U10.10(BL_IND) U10.12(RESV(DNC)) U10.13(RESV(DNC)) U10.14(INT) U10.21(RESV(DNC)) U10.22(RESV(DNC)) U10.23(RESV(DNC)) U10.24(RESV(DNC)) U10.26(XOUT32) U10.27(XIN32)

## Notes on the sheet
- FPGA | POWER | NEUROPIX
- Analog Ref
  - Internal VREF = 3.3V
- North-East
- NB: Programming interface
- North
- PIN 1 = leftmost pin, flex cable side odd numbers on flex cable side
  21 = PSB_SYNC 
  31 = PSB_DATA_0 
  30 = PSB_DATA_1 
  28 = PSB_DATA_2 
  27 = PSB_DATA_3 
  25 = PSB_DATA_4 
  24 = PSB_DATA_5 
  22 = PSB_DATA_6 
  33 = PSB_CLK
  18 = I2C_SDA 
  19 = I2C_SCL
  35 = MCLK [93.6 MHz]
  11 = CAL_SIGNAL 
  12 = OSC_PDOWN_N 
  15 = NRST 
  16 = REC_NRST [feedback for command delay measurement]
  3,4 = VDDA_1V8 
  7,8 = VDDA_1V2
  38,39 = VDDD_1V2 
  42,43 = VDDD_1V8
  1,2,5,6,9,10 = AGND 
  everything else = DGND
- North-West | NB:CLK0 drives PLL1.
- NP POR Sequence
  1. Digital 1.8V and 1.2V on
  2. Wait 10 msec (handled by Osc EN kinda: it takes 1.3 msec)
  3. Enable MCLK
  4. Wait 10 MCLK cycles
  5. NRST = 1 for 10 periods
  6. NRSET = 0 to reset
  7. Wait 200 msec
  8. Power on 1.8 analog
  9. Wait 1.8 ms
  10. Power on 1.2 analog
- NB: programmed to 93.6 MHz
- West
- NB: Input cap serves both LDOs
- NB: VCCIO = 1.8V for the neuropix interface. | NB: 1.8 msec delay
- IMU
- South-West
- I2C Selected
- NB To get the best performance out
  of BNO055, it is recommended to use
  the external 32.768 kHz crystal.
- South-East
- East
- 3D TRACKING
- SERIALIZER
- NB: Supply voltage 
  for PLL regulator 
  and ADC block 
  (analog). Also 
  determines ADC 
  max voltage. Use
  3.3V.
- NB: 0.1 is not needed.
- DEBUG
- NB: VCoax must NOT exceed 5.5V
- NB: Core logic is 
  LDOed from 
  VCC_ONE
- NB: Needed on
  POR to get LOCK

## Library data of the parts
C1-C59 = jonnew:C: Capacitor
C60-C62 = jonnew:C: Capacitor; PARTNO: CL03A105MP3ZSNH
C63-C65 = jonnew:C: Capacitor; PARTNO: C0603X5R1C104K030BC
D1 D2 = jonnew:LED: Surface mount LED
D3 = jonnew:Z-DIODE: Zener Diode
D4-D6 = jonnew:PHOTODIODE
J1 = jonnew:PINHD-2X5
J2 = jonnew:COAX: COAX CONNECTOR - Edge mount BNC - Vertical BNC - Vertical SMA - etc
J3 J5 = jonnew:PINHD-1X45
J4 = jonnew:JP2E
L1-L10 = jonnew:L: Inductor
R1-R36 = jonnew:R: Resistor
TP1-TP9 = jonnew:TP: Test pad
U1 = jonnew:10M08SAM153
U2 U11 = jonnew:CRYSTAL-OSC
U3 = jonnew:MAX494X
U4 U9 = jonnew:LDO_ADJUST-EN-SS
U5 = jonnew:DS90UB913A
U6 U8 = jonnew:TLV707
U7 = jonnew:TPS8268X
U10 = jonnew:BNO055
U12 = jonnew:CLKBUF2
U13-U15 = jonnew:TS4231
X2 = jonnew:OE-LOGO

## Net classes
1 diff: width 0.09 mm, drill 0.2 mm, clearance 0.09 mm